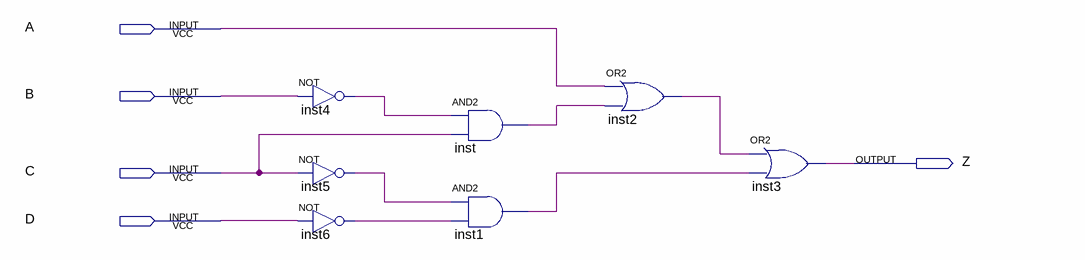
[diagram p0: schematic sheet]
// Quartus schematic ReconhecedorDeDigitosRA.bdf as structural Verilog: 7 symbols, 5 pins
module ReconhecedorDeDigitosRA (
  input  A,
  input  B,
  input  C,
  input  D,
  output Z
);

  wire inst1_out, inst2_out, inst4_out, inst5_out, inst6_out, inst_out;

  not inst4 (inst4_out, B);
  not inst5 (inst5_out, C);
  not inst6 (inst6_out, D);
  and inst (inst_out, inst4_out, C);
  and inst1 (inst1_out, inst5_out, inst6_out);
  or inst2 (inst2_out, A, inst_out);
  or inst3 (Z, inst2_out, inst1_out);
endmodule
